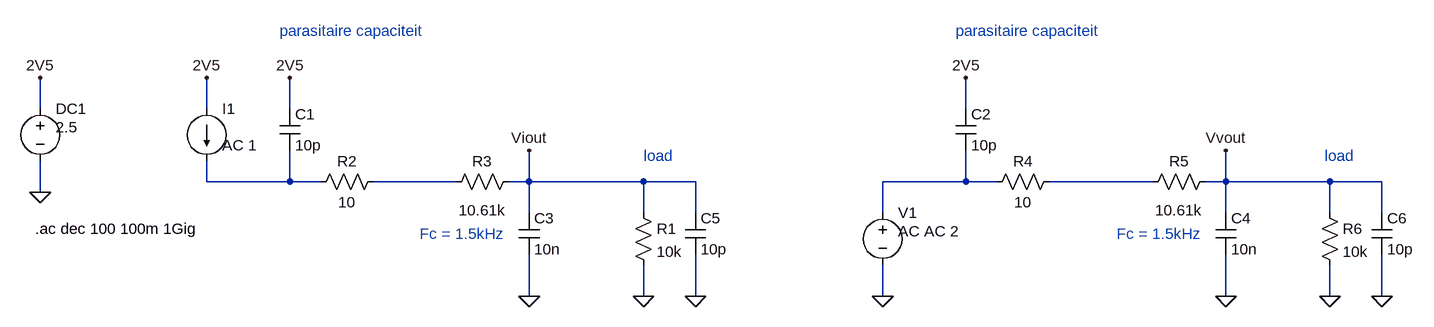
[diagram p0: schematic ltspice_rc.asc]
ltspice_rc.asc, the LTspice schematic file:
Version 4
SHEET 1 1032 680
WIRE -1168 -320 -1168 -368
WIRE -912 -320 -912 -368
WIRE -784 -320 -784 -368
WIRE 256 -320 256 -368
WIRE -912 -208 -912 -240
WIRE -784 -208 -784 -256
WIRE -784 -208 -912 -208
WIRE -736 -208 -784 -208
WIRE -528 -208 -656 -208
WIRE -416 -208 -416 -256
WIRE -416 -208 -448 -208
WIRE -240 -208 -416 -208
WIRE -160 -208 -240 -208
WIRE 256 -208 256 -256
WIRE 256 -208 128 -208
WIRE 304 -208 256 -208
WIRE 544 -208 384 -208
WIRE 656 -208 656 -256
WIRE 656 -208 624 -208
WIRE 816 -208 656 -208
WIRE 896 -208 816 -208
WIRE -1168 -192 -1168 -240
WIRE -416 -160 -416 -208
WIRE -240 -160 -240 -208
WIRE -160 -160 -160 -208
WIRE 128 -160 128 -208
WIRE 656 -160 656 -208
WIRE 816 -160 816 -208
WIRE 896 -160 896 -208
WIRE -416 -32 -416 -96
WIRE -240 -32 -240 -80
WIRE -160 -32 -160 -96
WIRE 128 -32 128 -80
WIRE 656 -32 656 -96
WIRE 816 -32 816 -80
WIRE 896 -32 896 -96
FLAG -416 -256 Viout
FLAG -1168 -368 2V5
FLAG -1168 -192 0
FLAG -912 -368 2V5
FLAG -784 -368 2V5
FLAG -416 -32 0
FLAG -240 -32 0
FLAG 656 -256 Vvout
FLAG 128 -32 0
FLAG 256 -368 2V5
FLAG 656 -32 0
FLAG 816 -32 0
FLAG -160 -32 0
FLAG 896 -32 0
SYMBOL res -640 -224 R90
WINDOW 0 0 56 VBottom 2
WINDOW 3 32 56 VTop 2
SYMATTR InstName R2
SYMATTR Value 10
SYMBOL voltage -1168 -336 R0
WINDOW 123 24 72 Left 2
WINDOW 39 0 0 Left 0
WINDOW 3 24 44 Left 2
SYMATTR Value 2.5
SYMATTR InstName DC1
SYMBOL current -912 -320 R0
WINDOW 3 24 28 Left 2
WINDOW 123 24 56 Left 2
WINDOW 39 0 0 Left 0
SYMATTR Value ""
SYMATTR Value2 AC 1
SYMATTR InstName I1
SYMBOL cap -800 -320 R0
SYMATTR InstName C1
SYMATTR Value 10p
SYMATTR SpiceLine V=10
SYMBOL res -432 -224 R90
WINDOW 0 0 56 VBottom 2
WINDOW 3 44 56 VTop 2
SYMATTR InstName R3
SYMATTR Value 10.61k
SYMBOL cap -432 -160 R0
SYMATTR InstName C3
SYMATTR Value 10n
SYMBOL res -256 -176 R0
SYMATTR InstName R1
SYMATTR Value 10k
SYMBOL res 400 -224 R90
WINDOW 0 0 56 VBottom 2
WINDOW 3 32 56 VTop 2
SYMATTR InstName R4
SYMATTR Value 10
SYMBOL cap 240 -320 R0
SYMATTR InstName C2
SYMATTR Value 10p
SYMATTR SpiceLine V=10
SYMBOL res 640 -224 R90
WINDOW 0 0 56 VBottom 2
WINDOW 3 44 56 VTop 2
SYMATTR InstName R5
SYMATTR Value 10.61k
SYMBOL cap 640 -160 R0
SYMATTR InstName C4
SYMATTR Value 10n
SYMBOL res 800 -176 R0
SYMATTR InstName R6
SYMATTR Value 10k
SYMBOL voltage 128 -176 R0
WINDOW 123 24 44 Left 2
WINDOW 39 0 0 Left 0
SYMATTR Value2 AC AC 2
SYMATTR InstName V1
SYMATTR Value ""
SYMBOL cap -176 -160 R0
SYMATTR InstName C5
SYMATTR Value 10p
SYMATTR SpiceLine V=10
SYMBOL cap 880 -160 R0
SYMATTR InstName C6
SYMATTR Value 10p
SYMATTR SpiceLine V=10
TEXT -1176 -136 Left 2 !.ac dec 100 100m 1Gig
TEXT -584 -128 Left 2 ;Fc = 1.5kHz
TEXT 488 -128 Left 2 ;Fc = 1.5kHz
TEXT -240 -248 Left 2 ;load
TEXT 808 -248 Left 2 ;load
TEXT -800 -440 Left 2 ;parasitaire capaciteit
TEXT 240 -440 Left 2 ;parasitaire capaciteit

The netlist it stands for:
* ltspice_rc.asc
R2 N002 N001 10
V§DC1 2V5 0 2.5
I1 2V5 N001 AC 1
C1 2V5 N001 10p V=10
R3 Viout N002 10.61k
C3 Viout 0 10n
R1 Viout 0 10k
R4 N004 N003 10
C2 2V5 N003 10p V=10
R5 Vvout N004 10.61k
C4 Vvout 0 10n
R6 Vvout 0 10k
V1 N003 0 AC AC 2
C5 Viout 0 10p V=10
C6 Vvout 0 10p V=10
.ac dec 100 100m 1Gig
* Fc = 1.5kHz
* Fc = 1.5kHz
* load
* load
* parasitaire capaciteit
* parasitaire capaciteit
.backanno
.end